# Altium schematic sheet Defectoscope2.SchDoc
size 594 x 420 mm; DocumentNumber: 55834732.2212.02 Э3; SheetNumber: 2; Format: A2
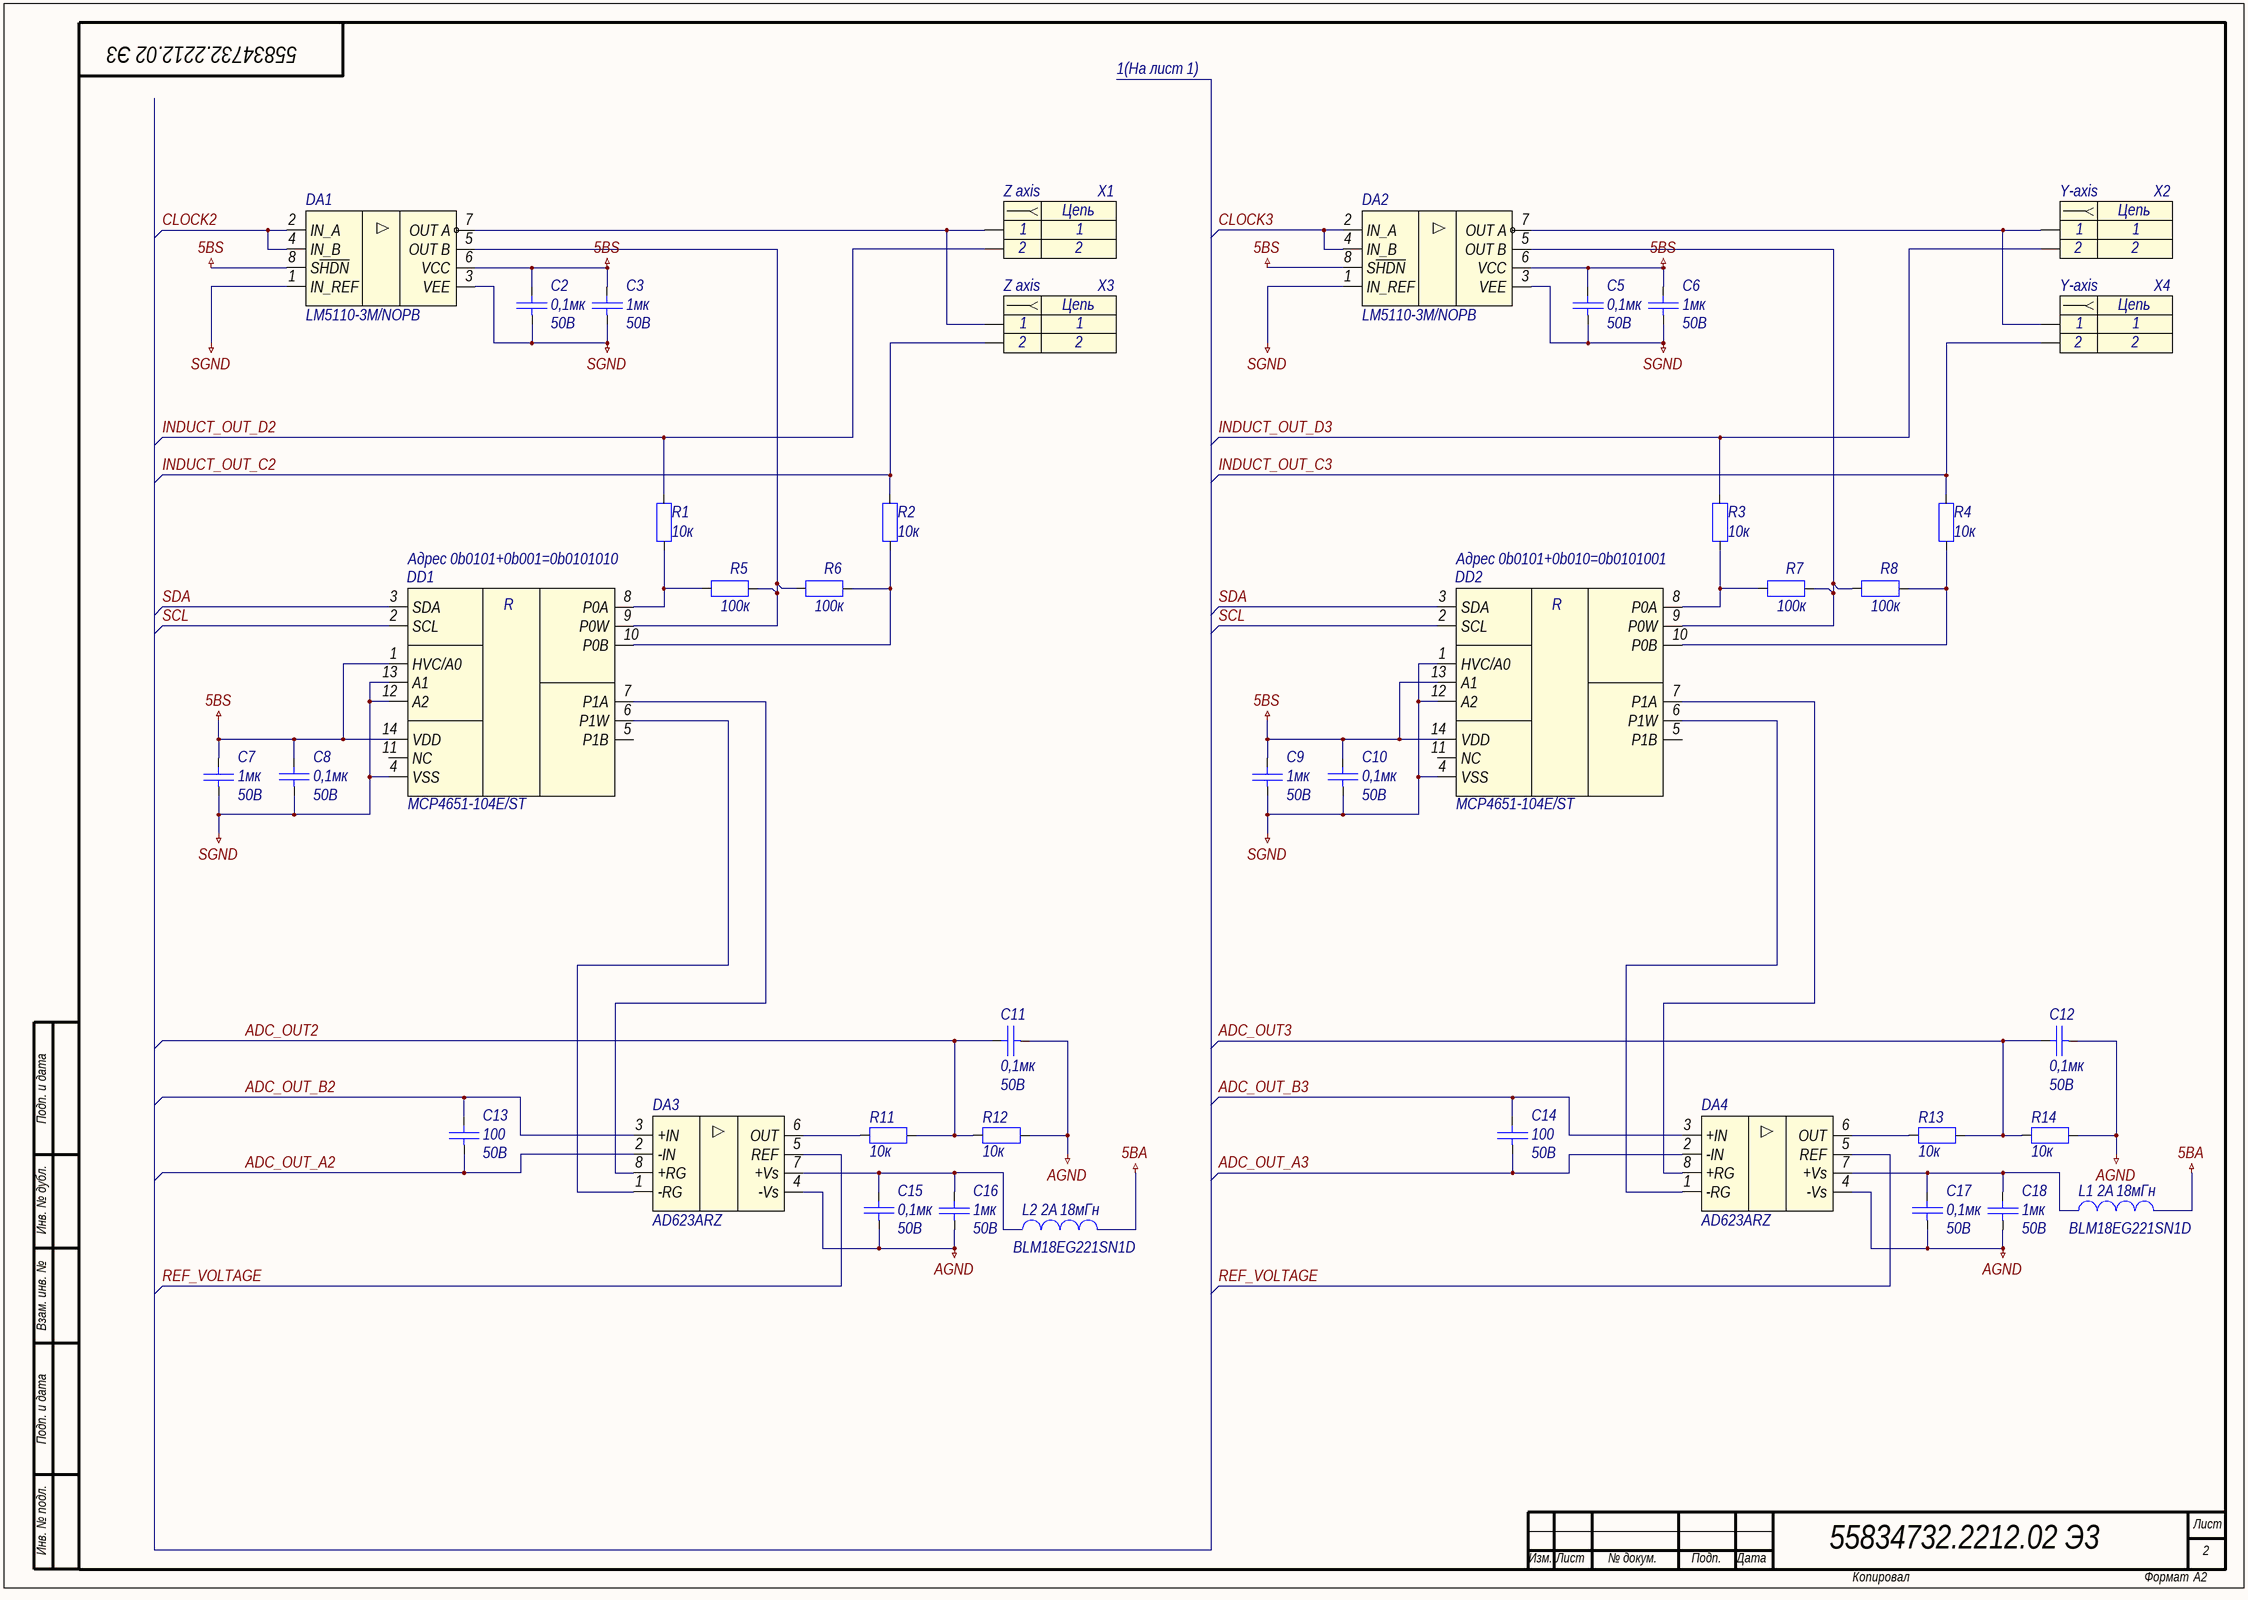
[diagram p0: Defectoscope2.SchDoc]

## Parts
C2  Voltage: 50В  [C0805]  (hidden comment: 0,1мк)
C3  Voltage: 50В  [C0805]  (hidden comment: 1мк)
C5  Voltage: 50В  [C0805]  (hidden comment: 0,1мк)
C6  Voltage: 50В  [C0805]  (hidden comment: 1мк)
C7  Voltage: 50В  [C0805]  (hidden comment: 1мк)
C8  Voltage: 50В  [C0805]  (hidden comment: 0,1мк)
C9  Voltage: 50В  [C0805]  (hidden comment: 1мк)
C10  Voltage: 50В  [C0805]  (hidden comment: 0,1мк)
C11  Voltage: 50В  [C0805]  (hidden comment: 0,1мк)
C12  Voltage: 50В  [C0805]  (hidden comment: 0,1мк)
C13  Voltage: 50В  [C0805]  (hidden comment: 100)
C14  Voltage: 50В  [C0805]  (hidden comment: 100)
C15  Voltage: 50В  [C0805]  (hidden comment: 0,1мк)
C16  Voltage: 50В  [C0805]  (hidden comment: 1мк)
C17  Voltage: 50В  [C0805]  (hidden comment: 0,1мк)
C18  Voltage: 50В  [C0805]  (hidden comment: 1мк)
DA1  LM5110-3M/NOPB  [SO8]
DA2  LM5110-3M/NOPB  [SO8]
DA3  AD623ARZ  [SO8]
DA4  AD623ARZ  [SO8]
DD1  MCP4651-104E/ST  [TSSOP14]
DD2  MCP4651-104E/ST  [TSSOP14]
L1  Name: BLM18EG221SN1D  Imax: 2А  [L0603]  (hidden comment: 18мГн)
L2  Name: BLM18EG221SN1D  Imax: 2А  [L0603]  (hidden comment: 18мГн)
R1  10к  [R0805]
R2  10к  [R0805]
R3  10к  [R0805]
R4  10к  [R0805]
R5  100к  [R0805]
R6  100к  [R0805]
R7  100к  [R0805]
R8  100к  [R0805]
R11  10к  [R0805]
R12  10к  [R0805]
R13  10к  [R0805]
R14  10к  [R0805]
X1  Z axis  [MW-2M]
X2  Y-axis  [MW-2M]
X3  Z axis  [MW-2M]
X4  Y-axis  [MW-2M]

## Nets
5BA: L1.2 L2.2
5BS: C2.2 C3.2 C5.2 C6.2 C7.2 C8.2 C9.2 C10.2 DA1.6(VCC) DA1.8(S~{HDN}) DA2.6(VCC) DA2.8(S~{HDN}) DD1.1(HVC/A0) DD1.14(VDD) DD2.13(A1) DD2.14(VDD)
AGND: C11.1 C12.1 C15.1 C16.1 C17.1 C18.1 DA3.4(-Vs) DA4.4(-Vs) R12.1 R14.1
SGND: C2.1 C3.1 C5.1 C6.1 C7.1 C8.1 C9.1 C10.1 DA1.1(IN_REF) DA1.3(VEE) DA2.1(IN_REF) DA2.3(VEE) DD1.4(VSS) DD1.12(A2) DD1.13(A1) DD2.1(HVC/A0) DD2.4(VSS) DD2.12(A2)
ADC_OUT2: C11.2 R11.1 R12.2
ADC_OUT3: C12.2 R13.1 R14.2
ADC_OUT_A2: C13.1 DA3.2(-IN)
ADC_OUT_A3: C14.1 DA4.2(-IN)
ADC_OUT_B2: C13.2 DA3.3(+IN)
ADC_OUT_B3: C14.2 DA4.3(+IN)
CLOCK2: DA1.2(IN_A) DA1.4(IN_B)
CLOCK3: DA2.2(IN_A) DA2.4(IN_B)
INDUCT_OUT_C2: R2.1 X3.2
INDUCT_OUT_C3: R4.1 X4.2
INDUCT_OUT_D2: R1.1 X1.2
INDUCT_OUT_D3: R3.1 X2.2
REF_VOLTAGE: DA3.5(REF) DA4.5(REF)
SCL: DD1.2(SCL) DD2.2(SCL)
SDA: DD1.3(SDA) DD2.3(SDA)
NetC15_2: C15.2 C16.2 DA3.7(+Vs) L2.1
NetC17_2: C17.2 C18.2 DA4.7(+Vs) L1.1
NetDA1_5: DA1.5(OUT_B) DD1.9(P0W) R5.2 R6.1
NetDA1_7: DA1.7(OUT_A) X1.1 X3.1
NetDA2_5: DA2.5(OUT_B) DD2.9(P0W) R7.2 R8.1
NetDA2_7: DA2.7(OUT_A) X2.1 X4.1
NetDA3_1: DA3.1(-RG) DD1.6(P1W)
NetDA3_6: DA3.6(OUT) R11.2
NetDA3_8: DA3.8(+RG) DD1.7(P1A)
NetDA4_1: DA4.1(-RG) DD2.6(P1W)
NetDA4_6: DA4.6(OUT) R13.2
NetDA4_8: DA4.8(+RG) DD2.7(P1A)
NetDD1_8: DD1.8(P0A) R1.2 R5.1
NetDD1_10: DD1.10(P0B) R2.2 R6.2
NetDD2_8: DD2.8(P0A) R3.2 R7.1
NetDD2_10: DD2.10(P0B) R4.2 R8.2

Not connected (* = marked no-connect by the designer): DD1 5(P1B) 11(NC); DD2 5(P1B) 11(NC)

## Notes on the sheet
- 1(На лист 1)
- (near R1) Адрес 0b0101+0b001=0b0101010
- Адрес 0b0101+0b010=0b0101001
- Подп. и дата
- Инв. № дубл.
- Взам. инв. №
- Инв. № подл.
- Лист
- Изм.
- № докум.
- Подп.
- Дата
- Копировал
- Формат
- (in symbol Header_2_sct) Цепь
- (in symbol MCP4651-103) R

## Library data of the parts
C2 C3 C5-C18 = Capacitor: Конденсатор
  C2 C5 C8 C10-C12 C15 C17: Value: 0,1мк
  C3 C6 C7 C9 C16 C18: Value: 1мк
  C13 C14: Value: 100
DA1 DA2 = LM5110: Драйвер затвора; Name: LM5110-3M/NOPB
DA3 DA4 = AD623ARZ: Инструментальный усилитель ±6В; Name: AD623ARZ
DD1 DD2 = MCP4651-103: Dual I2C Digital Potentiometer; Name: MCP4651-104E/ST
L1 L2 = Inductor: Катушка индуктивности; Value: 18мГн
R1-R8 R11-R14 = Resistor: Резистор
  R1-R4 R11-R14: Value: 10к
  R5-R8: Value: 100к
X1-X4 = Header_2_sct: Разъем - 2 конт. розетка; Contact_1: 1; Contact_2: 2
  X1 X3: Name: Z axis
  X2 X4: Name: Y-axis